# Altium schematic sheet Sheet1.SchDoc
size A4
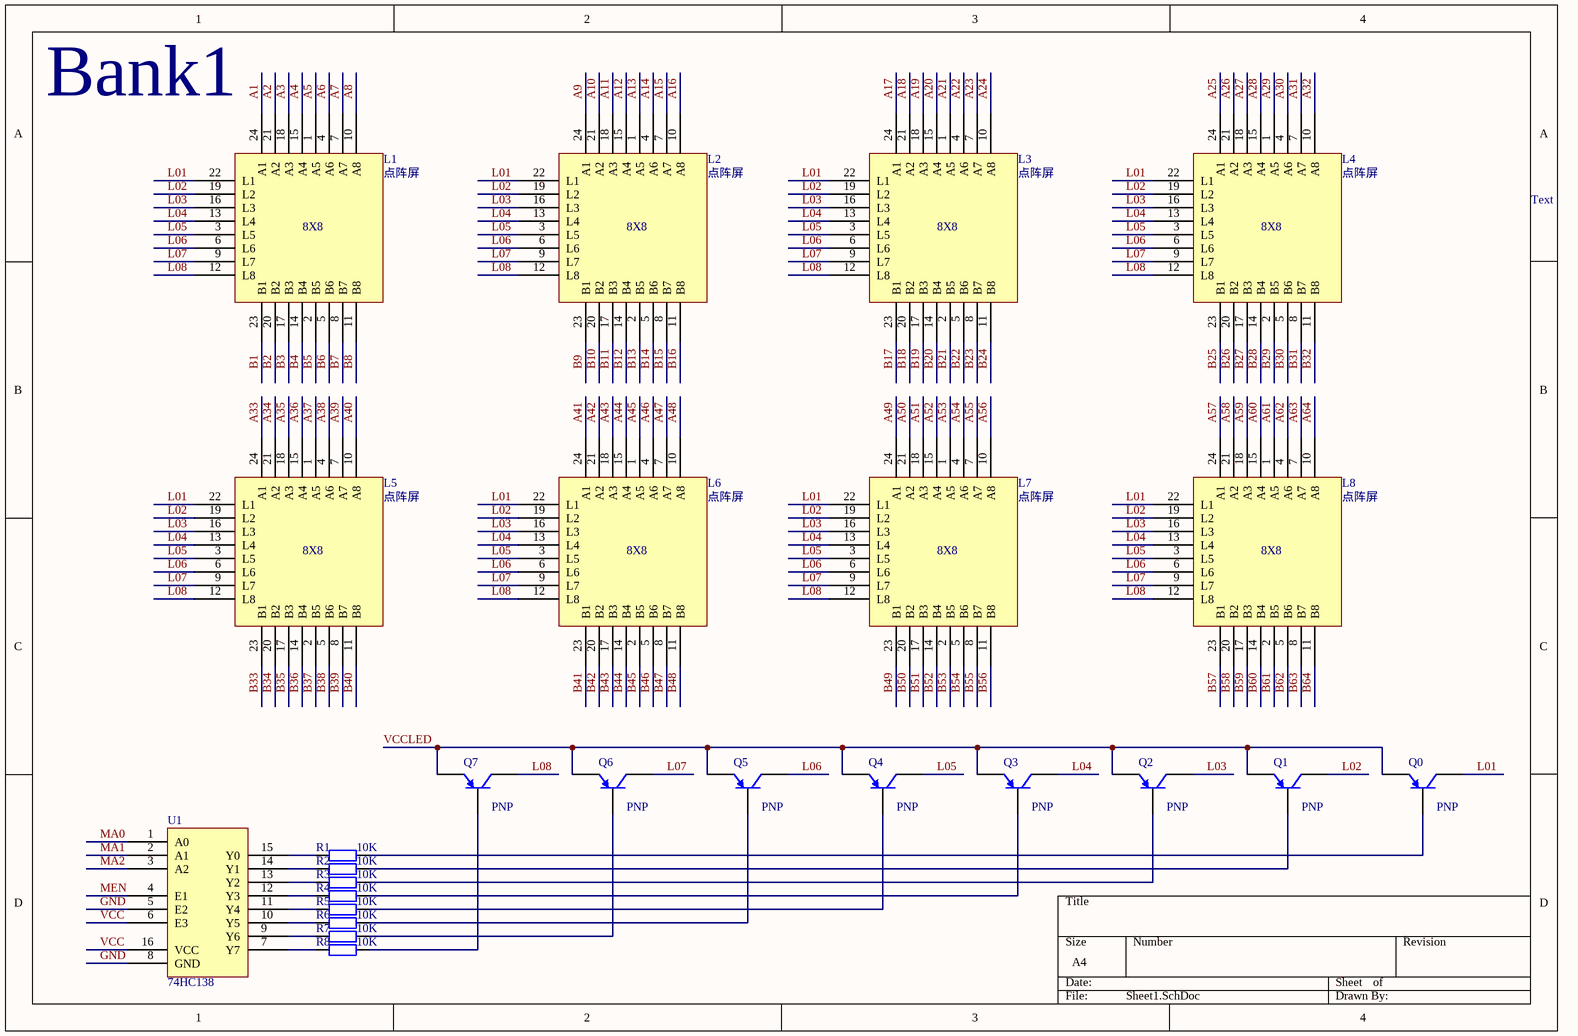
[diagram p0: Sheet1.SchDoc]

## Parts
L1  点阵屏
L2  点阵屏
L3  点阵屏
L4  点阵屏
L5  点阵屏
L6  点阵屏
L7  点阵屏
L8  点阵屏
Q0  PNP  [SOT-23B_N]
Q1  PNP  [SOT-23B_N]
Q2  PNP  [SOT-23B_N]
Q3  PNP  [SOT-23B_N]
Q4  PNP  [SOT-23B_N]
Q5  PNP  [SOT-23B_N]
Q6  PNP  [SOT-23B_N]
Q7  PNP  [SOT-23B_N]
R1  10K  [AXIAL-0.4]
R2  10K  [AXIAL-0.4]
R3  10K  [AXIAL-0.4]
R4  10K  [AXIAL-0.4]
R5  10K  [AXIAL-0.4]
R6  10K  [AXIAL-0.4]
R7  10K  [AXIAL-0.4]
R8  10K  [AXIAL-0.4]
U1  74HC138

## Nets
A1: L1.24(A1)
A2: L1.21(A2)
A3: L1.18(A3)
A4: L1.15(A4)
A5: L1.1(A5)
A6: L1.4(A6)
A7: L1.7(A7)
A8: L1.10(A8)
A9: L2.24(A1)
A10: L2.21(A2)
A11: L2.18(A3)
A12: L2.15(A4)
A13: L2.1(A5)
A14: L2.4(A6)
A15: L2.7(A7)
A16: L2.10(A8)
A17: L3.24(A1)
A18: L3.21(A2)
A19: L3.18(A3)
A20: L3.15(A4)
A21: L3.1(A5)
A22: L3.4(A6)
A23: L3.7(A7)
A24: L3.10(A8)
A25: L4.24(A1)
A26: L4.21(A2)
A27: L4.18(A3)
A28: L4.15(A4)
A29: L4.1(A5)
A30: L4.4(A6)
A31: L4.7(A7)
A32: L4.10(A8)
A33: L5.24(A1)
A34: L5.21(A2)
A35: L5.18(A3)
A36: L5.15(A4)
A37: L5.1(A5)
A38: L5.4(A6)
A39: L5.7(A7)
A40: L5.10(A8)
A41: L6.24(A1)
A42: L6.21(A2)
A43: L6.18(A3)
A44: L6.15(A4)
A45: L6.1(A5)
A46: L6.4(A6)
A47: L6.7(A7)
A48: L6.10(A8)
A49: L7.24(A1)
A50: L7.21(A2)
A51: L7.18(A3)
A52: L7.15(A4)
A53: L7.1(A5)
A54: L7.4(A6)
A55: L7.7(A7)
A56: L7.10(A8)
A57: L8.24(A1)
A58: L8.21(A2)
A59: L8.18(A3)
A60: L8.15(A4)
A61: L8.1(A5)
A62: L8.4(A6)
A63: L8.7(A7)
A64: L8.10(A8)
B1: L1.23(B1)
B2: L1.20(B2)
B3: L1.17(B3)
B4: L1.14(B4)
B5: L1.2(B5)
B6: L1.5(B6)
B7: L1.8(B7)
B8: L1.11(B8)
B9: L2.23(B1)
B10: L2.20(B2)
B11: L2.17(B3)
B12: L2.14(B4)
B13: L2.2(B5)
B14: L2.5(B6)
B15: L2.8(B7)
B16: L2.11(B8)
B17: L3.23(B1)
B18: L3.20(B2)
B19: L3.17(B3)
B20: L3.14(B4)
B21: L3.2(B5)
B22: L3.5(B6)
B23: L3.8(B7)
B24: L3.11(B8)
B25: L4.23(B1)
B26: L4.20(B2)
B27: L4.17(B3)
B28: L4.14(B4)
B29: L4.2(B5)
B30: L4.5(B6)
B31: L4.8(B7)
B32: L4.11(B8)
B33: L5.23(B1)
B34: L5.20(B2)
B35: L5.17(B3)
B36: L5.14(B4)
B37: L5.2(B5)
B38: L5.5(B6)
B39: L5.8(B7)
B40: L5.11(B8)
B41: L6.23(B1)
B42: L6.20(B2)
B43: L6.17(B3)
B44: L6.14(B4)
B45: L6.2(B5)
B46: L6.5(B6)
B47: L6.8(B7)
B48: L6.11(B8)
B49: L7.23(B1)
B50: L7.20(B2)
B51: L7.17(B3)
B52: L7.14(B4)
B53: L7.2(B5)
B54: L7.5(B6)
B55: L7.8(B7)
B56: L7.11(B8)
B57: L8.23(B1)
B58: L8.20(B2)
B59: L8.17(B3)
B60: L8.14(B4)
B61: L8.2(B5)
B62: L8.5(B6)
B63: L8.8(B7)
B64: L8.11(B8)
GND: U1.5(E2) U1.8(GND)
L01: L1.22(L1) L2.22(L1) L3.22(L1) L4.22(L1) L5.22(L1) L6.22(L1) L7.22(L1) L8.22(L1) Q0.1(C)
L02: L1.19(L2) L2.19(L2) L3.19(L2) L4.19(L2) L5.19(L2) L6.19(L2) L7.19(L2) L8.19(L2) Q1.1(C)
L03: L1.16(L3) L2.16(L3) L3.16(L3) L4.16(L3) L5.16(L3) L6.16(L3) L7.16(L3) L8.16(L3) Q2.1(C)
L04: L1.13(L4) L2.13(L4) L3.13(L4) L4.13(L4) L5.13(L4) L6.13(L4) L7.13(L4) L8.13(L4) Q3.1(C)
L05: L1.3(L5) L2.3(L5) L3.3(L5) L4.3(L5) L5.3(L5) L6.3(L5) L7.3(L5) L8.3(L5) Q4.1(C)
L06: L1.6(L6) L2.6(L6) L3.6(L6) L4.6(L6) L5.6(L6) L6.6(L6) L7.6(L6) L8.6(L6) Q5.1(C)
L07: L1.9(L7) L2.9(L7) L3.9(L7) L4.9(L7) L5.9(L7) L6.9(L7) L7.9(L7) L8.9(L7) Q6.1(C)
L08: L1.12(L8) L2.12(L8) L3.12(L8) L4.12(L8) L5.12(L8) L6.12(L8) L7.12(L8) L8.12(L8) Q7.1(C)
MA0: U1.1(A0)
MA1: U1.2(A1)
MA2: U1.3(A2)
MEN: U1.4(E1)
VCC: U1.6(E3) U1.16(VCC)
VCCLED: Q0.3(E) Q1.3(E) Q2.3(E) Q3.3(E) Q4.3(E) Q5.3(E) Q6.3(E) Q7.3(E)
NetQ0_2: Q0.2(B) R1.2
NetQ1_2: Q1.2(B) R2.2
NetQ2_2: Q2.2(B) R3.2
NetQ3_2: Q3.2(B) R4.2
NetQ4_2: Q4.2(B) R5.2
NetQ5_2: Q5.2(B) R6.2
NetQ6_2: Q6.2(B) R7.2
NetQ7_2: Q7.2(B) R8.2
NetR1_1: R1.1 U1.15(Y0)
NetR2_1: R2.1 U1.14(Y1)
NetR3_1: R3.1 U1.13(Y2)
NetR4_1: R4.1 U1.12(Y3)
NetR5_1: R5.1 U1.11(Y4)
NetR6_1: R6.1 U1.10(Y5)
NetR7_1: R7.1 U1.9(Y6)
NetR8_1: R8.1 U1.7(Y7)

## Notes on the sheet
- (near L1) Bank1
- Text
- (in symbol 点阵屏) 8X8

## Library data of the parts
Q0-Q7 = PNP: PNP Bipolar Transistor; Published: 8-Jun-2000; LatestRevisionDate: 29-May-2009; LatestRevisionNote: IPC-7351 Footprint Added.; PackageVersion: Aug-1999; PackageReference: SOT-23B; Publisher: Altium Limited; PackageDescription: 3-Pin SOT-23 Package 0.95 mm Pitch, 2.4 mm Lead Span
R1-R8 = Res2: Resistor; Published: 8-Jun-2000; LatestRevisionDate: 17-Jul-2002; LatestRevisionNote: Re-released for DXP Platform.; PackageReference: AXIAL-0.4; Publisher: Altium Limited; PackageDescription: Axial Device, Thru-Hole; 2 Leads; 0.4 in Pin Spacing